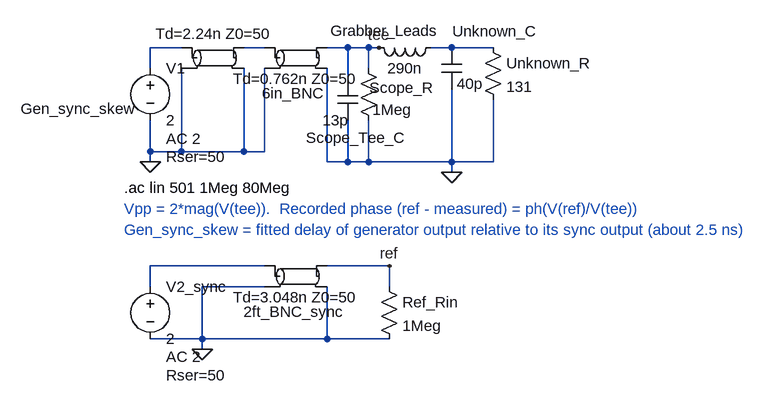
[diagram p0: schematic EC_model_matched.asc]
EC_model_matched.asc, the LTspice schematic file:
Version 4.1
SHEET 1 1120 680
WIRE 144 128 96 128
WIRE 272 128 240 128
WIRE 400 128 368 128
WIRE 432 128 400 128
WIRE 448 128 432 128
WIRE 560 128 528 128
WIRE 624 128 560 128
WIRE 96 160 96 128
WIRE 432 160 432 128
WIRE 400 176 400 128
WIRE 96 288 96 240
WIRE 144 288 144 160
WIRE 144 288 96 288
WIRE 240 288 240 160
WIRE 240 288 144 288
WIRE 272 288 272 160
WIRE 272 288 240 288
WIRE 96 304 96 288
WIRE 368 304 368 160
WIRE 400 304 400 240
WIRE 400 304 368 304
WIRE 432 304 432 240
WIRE 432 304 400 304
WIRE 560 304 560 192
WIRE 560 304 432 304
WIRE 624 304 624 208
WIRE 624 304 560 304
WIRE 560 320 560 304
WIRE 272 464 96 464
WIRE 464 464 368 464
WIRE 96 496 96 464
WIRE 272 496 176 496
WIRE 464 496 464 464
WIRE 176 576 176 496
WIRE 176 576 96 576
WIRE 368 576 368 496
WIRE 368 576 176 576
WIRE 464 576 368 576
WIRE 176 592 176 576
FLAG 96 304 0
FLAG 560 320 0
FLAG 448 128 tee
FLAG 176 592 0
FLAG 464 464 ref
SYMBOL voltage 96 144 R0
WINDOW 123 24 124 Left 2
WINDOW 39 24 152 Left 2
SYMATTR Value2 AC 2
SYMATTR SpiceLine Rser=50
SYMATTR InstName V1
SYMATTR Value 2
SYMBOL tline 320 144 R0
WINDOW 0 -4 70 Bottom 2
SYMATTR InstName 6in_BNC
SYMATTR Value Td=0.762n Z0=50
SYMBOL res 608 112 R0
SYMATTR InstName Unknown_R
SYMATTR Value 131
SYMBOL cap 544 128 R0
WINDOW 0 17 -25 Left 2
SYMATTR InstName Unknown_C
SYMATTR Value 40p
SYMBOL ind 544 112 R90
WINDOW 0 6 86 VBottom 2
WINDOW 3 32 56 VTop 2
SYMATTR InstName Grabber_Leads
SYMATTR Value 290n
SYMATTR SpiceLine Rser=1m
SYMBOL cap 384 176 R0
WINDOW 0 -48 91 Left 2
WINDOW 3 -23 64 Left 2
SYMATTR InstName Scope_Tee_C
SYMATTR Value 13p
SYMBOL res 416 144 R0
WINDOW 0 17 46 Left 2
WINDOW 3 22 80 Left 2
SYMATTR InstName Scope_R
SYMATTR Value 1Meg
SYMBOL tline 192 144 R0
WINDOW 0 -207 94 Bottom 2
WINDOW 3 2 -53 Top 2
SYMATTR InstName Gen_sync_skew
SYMATTR Value Td=2.24n Z0=50
SYMBOL voltage 96 480 R0
WINDOW 123 24 124 Left 2
WINDOW 39 24 152 Left 2
SYMATTR Value2 AC 2
SYMATTR SpiceLine Rser=50
SYMATTR InstName V2_sync
SYMATTR Value 2
SYMBOL tline 320 480 R0
WINDOW 0 -4 70 Bottom 2
SYMATTR InstName 2ft_BNC_sync
SYMATTR Value Td=3.048n Z0=50
SYMBOL res 448 480 R0
SYMATTR InstName Ref_Rin
SYMATTR Value 1Meg
TEXT 56 344 Left 2 !.ac lin 501 1Meg 80Meg
TEXT 56 376 Left 2 ;Vpp = 2*mag(V(tee)).  Recorded phase (ref - measured) = ph(V(ref)/V(tee))
TEXT 56 408 Left 2 ;Gen_sync_skew = fitted delay of generator output relative to its sync output (about 2.5 ns)

The netlist it stands for:
* EC_model_matched.asc
V1 N001 0 2 AC 2 Rser=50
T§6in_BNC N002 0 tee 0 Td=0.762n Z0=50
R§Unknown_R N003 0 131
C§Unknown_C N003 0 40p
L§Grabber_Leads N003 tee 290n Rser=1m
C§Scope_Tee_C tee 0 13p
R§Scope_R tee 0 1Meg
T§Gen_sync_skew N001 0 N002 0 Td=2.24n Z0=50
V2_sync N004 0 2 AC 2 Rser=50
T§2ft_BNC_sync N004 0 ref 0 Td=3.048n Z0=50
Ref_Rin ref 0 1Meg
.ac lin 501 1Meg 80Meg
* Vpp = 2*mag(V(tee)).  Recorded phase (ref - measured) = ph(V(ref)/V(tee))
* Gen_sync_skew = fitted delay of generator output relative to its sync output (about 2.5 ns)
.backanno
.end